# EAGLE schematic BMS_Rev2_SSR (EAGLE 7.0.0)
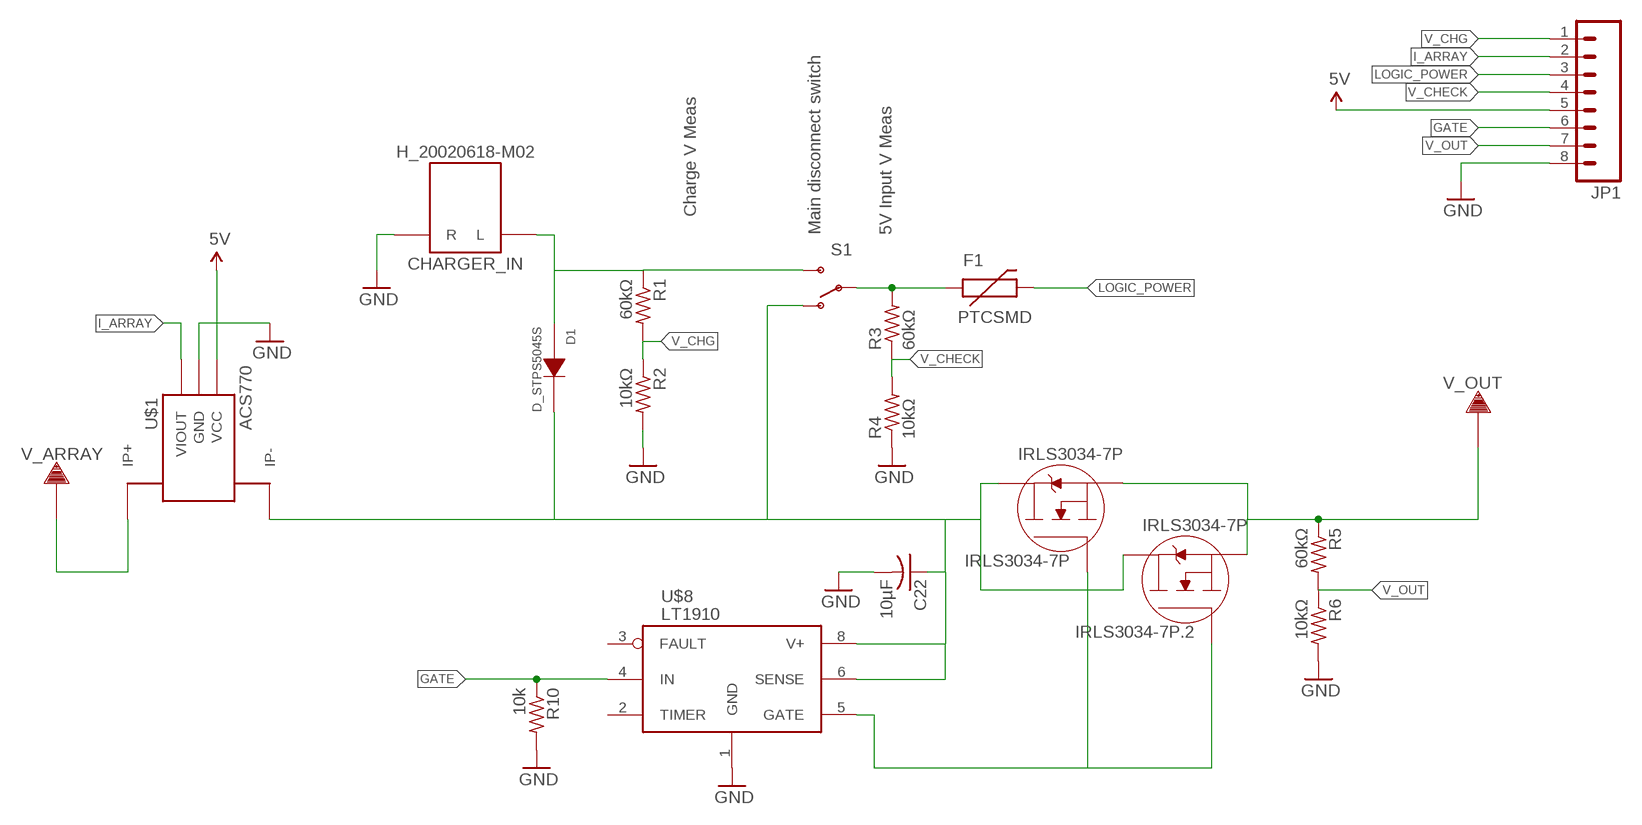
[diagram p0: schematic, sheet 1]

## Parts
C22  10µF  C-USC1206  [C1206]
CHARGER_IN  H_20020618-M02  [20020618-M02]
D1  D_STPS5045S  [D2PACK]
F1  PTCSMD  [PTC-1206]
IRLS3034-7P  IRLS3034-7P  [D2PAK-7]
IRLS3034-7P.2  IRLS3034-7P  [D2PAK-7]
JP1  M08BM08B-SRSS-TB  [BM08B-SRSS-TB]
R1  60kΩ  R-US_R1206  [R1206]
R2  10kΩ  R-US_R1206  [R1206]
R3  60kΩ  R-US_R1206  [R1206]
R4  10kΩ  R-US_R1206  [R1206]
R5  60kΩ  R-US_R1206  [R1206]
R6  10kΩ  R-US_R1206  [R1206]
R10  10k  R-US_R1206  [R1206]
S1  SWITCH-SPDTPTH  [SWITCH-SPDT]
U$1  ACS770  [PFF_LEADFORM]
U$8  LT1910  [SO8]
V_ARRAY  TERMINAL_HOLE  [LARGE_TERMINAL_HOLE]
V_OUT  TERMINAL_HOLE  [LARGE_TERMINAL_HOLE]

## Nets
5V: JP1.5 U$1.1(VCC)
GATE: JP1.6 R10.1 U$8.4(IN)
GND: C22.2 CHARGER_IN.R1(R) CHARGER_IN.R2(R) JP1.8 R2.2 R4.1 R6.2 R10.2 U$1.2(GND) U$8.1(GND)
I_ARRAY: JP1.2 U$1.3(VIOUT)
LOGIC_POWER: F1.2 JP1.3
N$1: IRLS3034-7P.2(SOURCE) IRLS3034-7P.2.2(SOURCE) IRLS3034-7P.2.3(SOURCE) IRLS3034-7P.2.4(SOURCE) IRLS3034-7P.2.5(SOURCE) IRLS3034-7P.2.6(SOURCE) IRLS3034-7P.3(SOURCE) IRLS3034-7P.4(SOURCE) IRLS3034-7P.5(SOURCE) IRLS3034-7P.6(SOURCE) R5.1 V_OUT.P$1
N$2: U$1.4_1(IP+) U$1.4_2(IP+) U$1.4_3(IP+) U$1.4_4(IP+) U$1.4_5(IP+) U$1.4_6(IP+) U$1.4_7(IP+) U$1.4_8(IP+) U$1.4_9(IP+) U$1.4_10(IP+) U$1.4_11(IP+) U$1.4_12(IP+) U$1.4_13(IP+) U$1.4_14(IP+) U$1.4_15(IP+) U$1.4_16(IP+) U$1.4_B(IP+) U$1.4_T(IP+) V_ARRAY.P$1
N$3: C22.1 D1.TAB(K) IRLS3034-7P.2.PAD(DRAIN) IRLS3034-7P.PAD(DRAIN) S1.1(O) U$1.5_1(IP-) U$1.5_2(IP-) U$1.5_3(IP-) U$1.5_4(IP-) U$1.5_5(IP-) U$1.5_6(IP-) U$1.5_7(IP-) U$1.5_8(IP-) U$1.5_9(IP-) U$1.5_10(IP-) U$1.5_11(IP-) U$1.5_12(IP-) U$1.5_13(IP-) U$1.5_14(IP-) U$1.5_15(IP-) U$1.5_16(IP-) U$1.5_B(IP-) U$1.5_T(IP-) U$8.6(SENSE) U$8.8(V+)
N$4: CHARGER_IN.L1(L) CHARGER_IN.L2(L) D1.1(A) D1.2(A) R1.1 S1.3(S)
N$5: IRLS3034-7P.1(GATE) IRLS3034-7P.2.1(GATE) U$8.5(GATE)
N$6: F1.1 R3.2 S1.2(P)
V_CHECK: JP1.4 R3.1 R4.2
V_CHG: JP1.1 R1.2 R2.1
V_OUT: JP1.7 R5.2 R6.1
Unconnected: U$8.2(TIMER) U$8.3(FAULT)

## Notes on the sheet
- Charge V Meas
- Main disconnect switch | 5V Input V Meas

## Library data of the parts
C22 = resistor:C-US: CAPACITOR, American symbol
CHARGER_IN = MRDT-2015-PowerBoard:H_20020618-M02*: 20020618-M02* header pin from FCI. Rated up to 32A
D1 = MRDT-2015-BMS:D_STPS5045S
F1 = SparkFun-PowerIC:PTC: Resettable Fuse PTC Resettable Fuse. Spark Fun Electronics SKU : COM-08357; PROD_ID: RES-11150
IRLS3034-7P IRLS3034-7P.2 = MRDT-2015-BMS:IRLS3034-7P: High-current SMD MOSFET
JP1 = SparkFun-Connectors:M08: Header 8 Standard 8-pin 0.1" header. Use with straight break away headers (SKU : PRT-00116), right angle break away headers (PRT-00553), swiss pins (PRT-00743), machine pins (PRT-00117), and female headers (PRT-00115).
R1-R6 R10 = resistor:R-US_: RESISTOR, American symbol
S1 = SparkFun-Electromechanical:SWITCH-SPDT: SPDT Switch Simple slide switch, Spark Fun Electronics SKU : COM-00102 DPDT SMT slide switch, AYZ0202, SWCH-08179
U$1 = MRDT-2015-BMS:ACS770
U$8 = MRDT-2015-PowerBoard:LT1910
V_ARRAY V_OUT = MRDT-2015-PowerBoard:TERMINAL_HOLE